# Altium schematic sheet Triple_Phase_Bridge.SchDoc
size A4; Organization: Altium Limited; Address1: L3, 12a Rodborough Rd; Address2: Frenchs Forest; Address3: NSW; Address4: Australia 2086
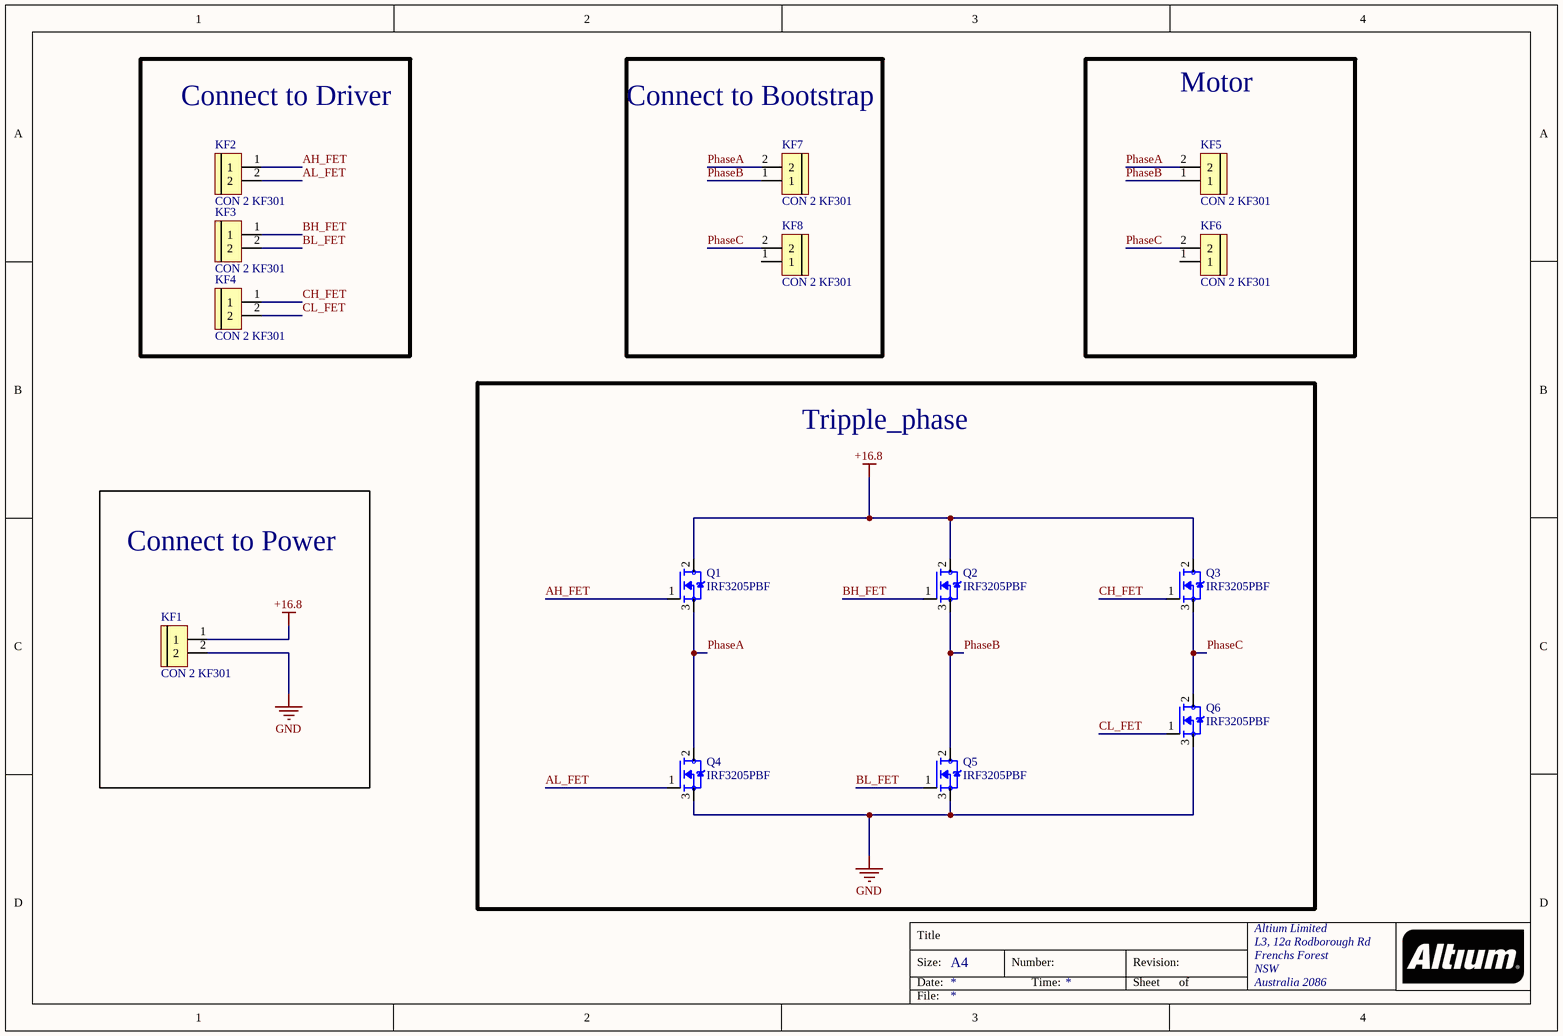
[diagram p0: Triple_Phase_Bridge.SchDoc]

## Parts
KF1  CON 2 KF301  [Con 2 KF301 5.08]
KF2  CON 2 KF301  [Con 2 KF301 5.08]
KF3  CON 2 KF301  [Con 2 KF301 5.08]
KF4  CON 2 KF301  [Con 2 KF301 5.08]
KF5  CON 2 KF301  [Con 2 KF301 5.08]
KF6  CON 2 KF301  [Con 2 KF301 5.08]
KF7  CON 2 KF301  [Con 2 KF301 5.08]
KF8  CON 2 KF301  [Con 2 KF301 5.08]
Q1  IRF3205PBF  [TO254P1067X483X3124-3P]
Q2  IRF3205PBF  [TO254P1067X483X3124-3P]
Q3  IRF3205PBF  [TO254P1067X483X3124-3P]
Q4  IRF3205PBF  [TO254P1067X483X3124-3P]
Q5  IRF3205PBF  [TO254P1067X483X3124-3P]
Q6  IRF3205PBF  [TO254P1067X483X3124-3P]

## Blocks framed on the sheet
Connect to Driver: KF2-KF4
Connect to Bootstrap: KF7 KF8
Motor: KF5 KF6
Tripple_phase: Q1-Q6
Connect to Power: KF1

## Nets
+16.8: KF1.1 Q1.2(D) Q2.2(D) Q3.2(D)
GND: KF1.2 Q4.3(S) Q5.3(S) Q6.3(S)
AH_FET: KF2.1 Q1.1(G)
AL_FET: KF2.2 Q4.1(G)
BH_FET: KF3.1 Q2.1(G)
BL_FET: KF3.2 Q5.1(G)
CH_FET: KF4.1 Q3.1(G)
CL_FET: KF4.2 Q6.1(G)
PhaseA: KF5.2 KF7.2 Q1.3(S) Q4.2(D)
PhaseB: KF5.1 KF7.1 Q2.3(S) Q5.2(D)
PhaseC: KF6.2 KF8.2 Q3.3(S) Q6.2(D)

Not connected (* = marked no-connect by the designer): KF6 1; KF8 1

## Notes on the sheet
- Title
- Size:
- Date:
- A4
- Number:
- Time:
- Revision:
- Sheet
- of
- File:

## Library data of the parts
KF1-KF8 = CON 2 KF301: Cắm; Ma_Hang: MH000987; Ten_Linh_Kien: CON 2 KF301-2P 5.08MM Xanh Dương; Chung_Loai: Cắm; Ghi_Chu: *; Kieu_Chan: *; Don_Vi: Con
Q1-Q6 = IRF3205PBF: N-Channel 55V 110A _Tc_ 200W _Tc_ Through Hole TO-220AB; MF: Infineon Technologies; Package: TO-220 International Rectifier; MP: IRF3205PBF; Value: *; Availability: Unavailable; Price: None; SnapEDA_Link: https://www.snapeda.com/parts/IRF3205PBF/Infineon%20Technologies/view-part/98571/?ref=snap